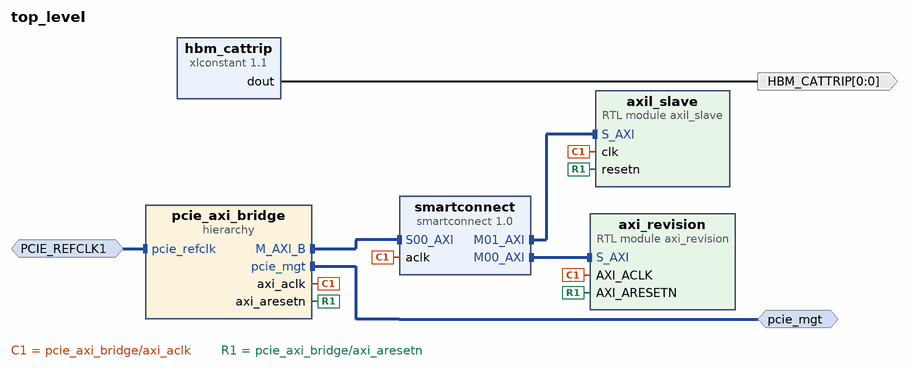
[diagram p0: block diagram of the top level]
# Vivado block design top_level, xcu50-fsvh2104-2-e, Vivado 2021.1
create_bd_design top_level

create_bd_intf_port -mode Slave -vlnv xilinx.com:interface:diff_clock_rtl:1.0 PCIE_REFCLK1
create_bd_intf_port -mode Master -vlnv xilinx.com:interface:pcie_7x_mgt_rtl:1.0 pcie_mgt
create_bd_port -dir O -from 0 -to 0 HBM_CATTRIP

create_bd_cell -type hier pcie_axi_bridge
create_bd_cell -type ip -vlnv xilinx.com:ip:smartconnect:1.0 smartconnect
set_property -dict {CONFIG.HAS_ARESETN 0 CONFIG.NUM_MI 2 CONFIG.NUM_SI 1} [get_bd_cells smartconnect]
create_bd_cell -type module -reference axi_revision axi_revision
create_bd_cell -type module -reference axil_slave axil_slave
create_bd_cell -type ip -vlnv xilinx.com:ip:xlconstant:1.1 hbm_cattrip
set_property -dict {CONFIG.CONST_VAL 0} [get_bd_cells hbm_cattrip]

# ---- hierarchy /pcie_axi_bridge ----
current_bd_instance /pcie_axi_bridge
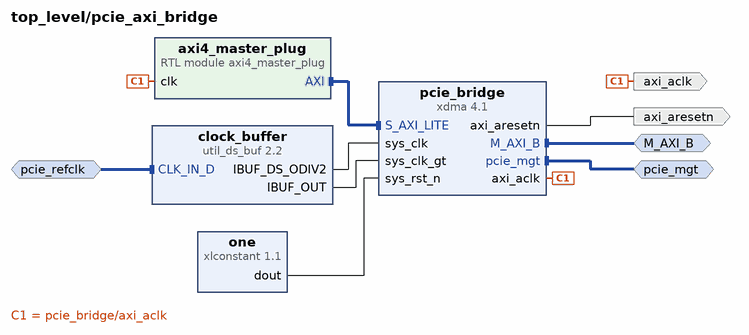
[diagram p1: block diagram inside /pcie_axi_bridge]
create_bd_intf_pin -mode Slave -vlnv xilinx.com:interface:diff_clock_rtl:1.0 pcie_refclk
create_bd_intf_pin -mode Master -vlnv xilinx.com:interface:pcie_7x_mgt_rtl:1.0 pcie_mgt
create_bd_intf_pin -mode Master -vlnv xilinx.com:interface:aximm_rtl:1.0 M_AXI_B
create_bd_pin -dir O axi_aresetn
create_bd_pin -dir O axi_aclk

create_bd_cell -type ip -vlnv xilinx.com:ip:xdma:4.1 pcie_bridge
set_property -dict [list \
  CONFIG.PCIE_BOARD_INTERFACE pci_express_x16 \
  CONFIG.PF0_DEVICE_ID_mqdma 903F \
  CONFIG.PF0_SRIOV_VF_DEVICE_ID A03F \
  CONFIG.PF2_DEVICE_ID_mqdma 923F \
  CONFIG.PF3_DEVICE_ID_mqdma 933F \
  CONFIG.axi_addr_width 64 \
  CONFIG.axi_data_width 512_bit \
  CONFIG.axisten_freq 250 \
  CONFIG.bridge_burst true \
  CONFIG.en_axi_slave_if false \
  CONFIG.functional_mode AXI_Bridge \
  CONFIG.mode_selection Advanced \
  CONFIG.pf0_bar0_scale Megabytes \
  CONFIG.pf0_bar0_size 1 \
  CONFIG.pf0_bar1_enabled true \
  CONFIG.pf0_bar1_scale Megabytes \
  CONFIG.pf0_bar1_size 1 \
  CONFIG.pf0_device_id 903F \
  CONFIG.pl_link_cap_max_link_speed 8.0_GT/s \
  CONFIG.plltype QPLL1 \
] [get_bd_cells pcie_bridge]
create_bd_cell -type ip -vlnv xilinx.com:ip:util_ds_buf:2.2 clock_buffer
set_property -dict {CONFIG.DIFF_CLK_IN_BOARD_INTERFACE pcie_refclk} [get_bd_cells clock_buffer]
create_bd_cell -type ip -vlnv xilinx.com:ip:xlconstant:1.1 one
create_bd_cell -type module -reference axi4_master_plug axi4_master_plug

# ---- connections ----

current_bd_instance /pcie_axi_bridge
connect_bd_intf_net -intf_net CLK_IN_D_0_1 [get_bd_intf_pins pcie_refclk] [get_bd_intf_pins clock_buffer/CLK_IN_D]
connect_bd_intf_net [get_bd_intf_pins pcie_mgt] [get_bd_intf_pins pcie_bridge/pcie_mgt]
connect_bd_intf_net -intf_net axi4_master_plug_0_AXI [get_bd_intf_pins axi4_master_plug/AXI] [get_bd_intf_pins pcie_bridge/S_AXI_LITE]
connect_bd_intf_net [get_bd_intf_pins M_AXI_B] [get_bd_intf_pins pcie_bridge/M_AXI_B]
connect_bd_net [get_bd_pins clock_buffer/IBUF_DS_ODIV2] [get_bd_pins pcie_bridge/sys_clk]
connect_bd_net [get_bd_pins clock_buffer/IBUF_OUT] [get_bd_pins pcie_bridge/sys_clk_gt]
connect_bd_net [get_bd_pins one/dout] [get_bd_pins pcie_bridge/sys_rst_n]
connect_bd_net [get_bd_pins pcie_bridge/axi_aclk] [get_bd_pins axi_aclk] [get_bd_pins axi4_master_plug/clk]
connect_bd_net [get_bd_pins pcie_bridge/axi_aresetn] [get_bd_pins axi_aresetn]

current_bd_instance /
connect_bd_intf_net -intf_net CLK_IN_D_0_1 [get_bd_intf_ports PCIE_REFCLK1] [get_bd_intf_pins pcie_axi_bridge/pcie_refclk]
connect_bd_intf_net [get_bd_intf_pins pcie_axi_bridge/M_AXI_B] [get_bd_intf_pins smartconnect/S00_AXI]
connect_bd_intf_net [get_bd_intf_ports pcie_mgt] [get_bd_intf_pins pcie_axi_bridge/pcie_mgt]
connect_bd_intf_net [get_bd_intf_pins axi_revision/S_AXI] [get_bd_intf_pins smartconnect/M00_AXI]
connect_bd_intf_net [get_bd_intf_pins axil_slave/S_AXI] [get_bd_intf_pins smartconnect/M01_AXI]
connect_bd_net [get_bd_pins hbm_cattrip/dout] [get_bd_ports HBM_CATTRIP]
connect_bd_net [get_bd_pins pcie_axi_bridge/axi_aclk] [get_bd_pins smartconnect/aclk] [get_bd_pins axi_revision/AXI_ACLK] [get_bd_pins axil_slave/clk]
connect_bd_net [get_bd_pins pcie_axi_bridge/axi_aresetn] [get_bd_pins axi_revision/AXI_ARESETN] [get_bd_pins axil_slave/resetn]

# ---- address map ----
assign_bd_address -offset 0x00000000 -range 512M -target_address_space [get_bd_addr_spaces pcie_axi_bridge/axi4_master_plug/AXI] [get_bd_addr_segs pcie_axi_bridge/pcie_bridge/S_AXI_LITE/CTL0]
assign_bd_address -offset 0x0000000000000000 -range 256 -target_address_space [get_bd_addr_spaces pcie_axi_bridge/pcie_bridge/M_AXI_B] [get_bd_addr_segs axi_revision/S_AXI/reg0]
assign_bd_address -offset 0x0000000000001000 -range 256 -target_address_space [get_bd_addr_spaces pcie_axi_bridge/pcie_bridge/M_AXI_B] [get_bd_addr_segs axil_slave/S_AXI/reg0]

validate_bd_design
save_bd_design
